# Altium schematic sheet V1.SchDoc
size A3
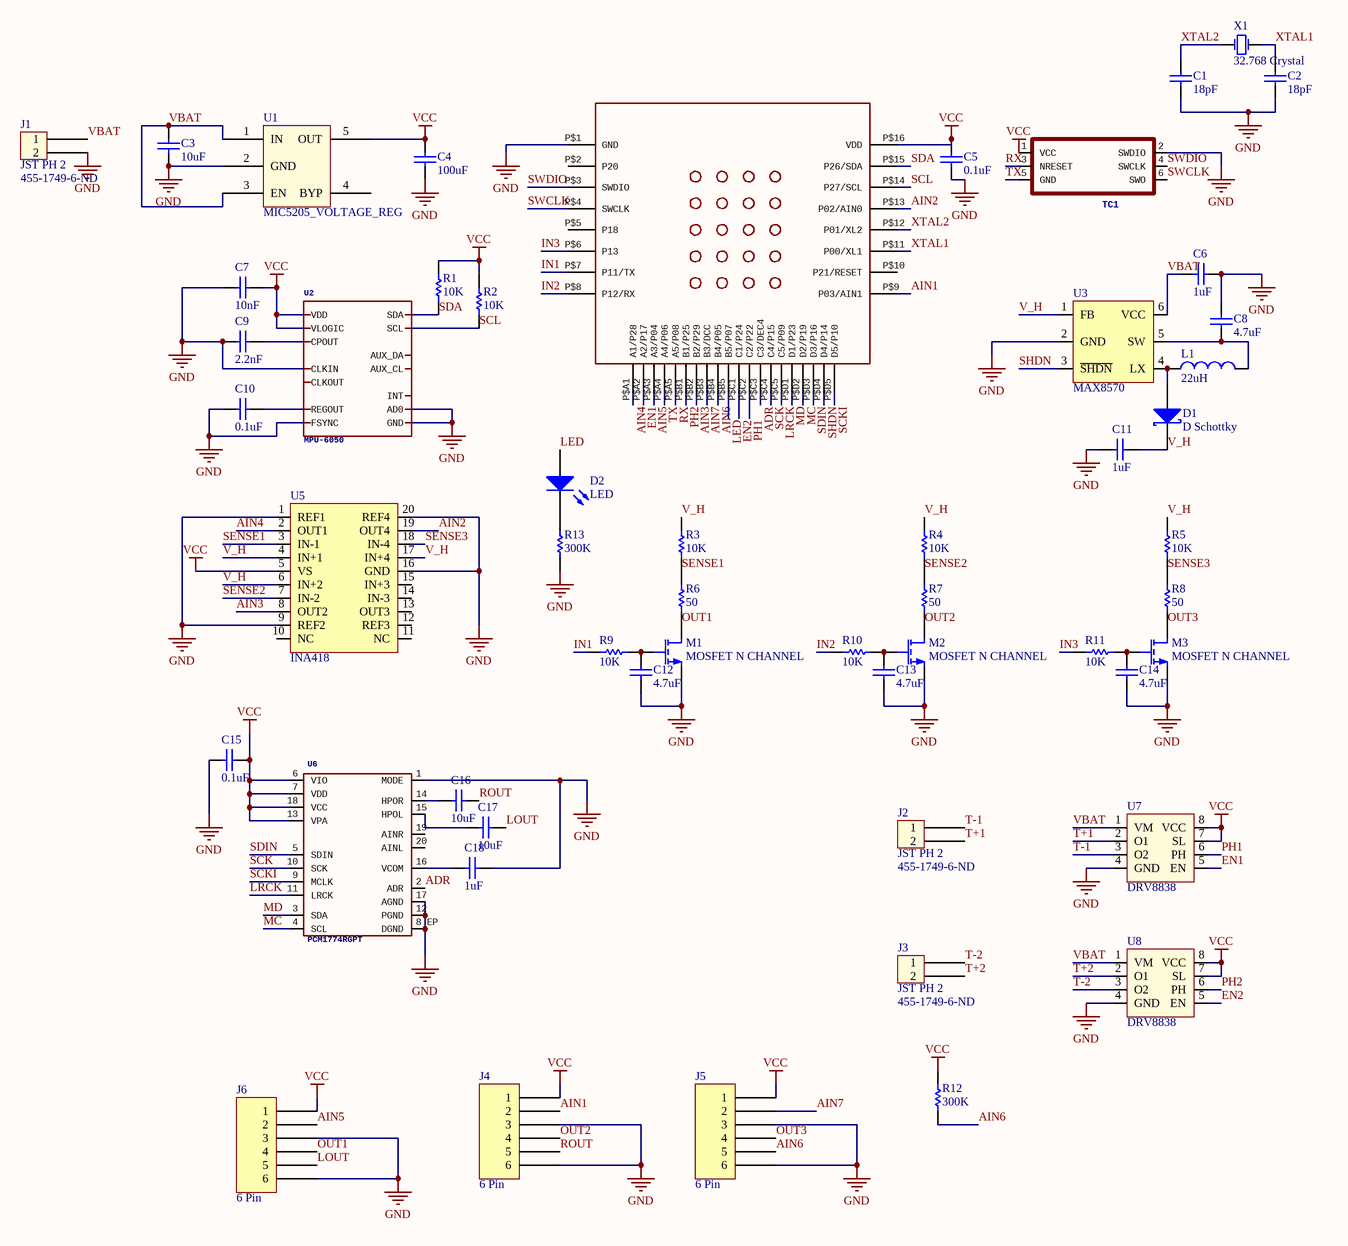
[diagram p0: V1.SchDoc]

## Parts
C1  18pF  [0603W]
C2  18pF  [0603W]
C3  10uF  [0603W]
C4  100uF  [0603W]
C5  0.1uF  [0603W]
C6  1uF  [0603W]
C7  10nF  [0603W]
C8  4.7uF  [0603W]
C9  2.2nF  [0603W]
C10  0.1uF  [0603W]
C11  1uF  [0603W]
C12  4.7uF  [0603W]
C13  4.7uF  [0603W]
C14  4.7uF  [0603W]
C15  0.1uF  [0603W]
C16  10uF  [0603W]
C17  10uF  [0603W]
C18  1uF  [0603W]
D1  D Schottky  [0603W]
D2  LED  [0603 LED]
J1  JST PH 2  Supplier Part Number 1: 455-1749-6-ND  [JST PH 2]
J2  JST PH 2  Supplier Part Number 1: 455-1749-6-ND  [JST PH 2]
J3  JST PH 2  Supplier Part Number 1: 455-1749-6-ND  [JST PH 2]
J4  6 Pin  [JST SM06B-SRSS-TB]
J5  6 Pin  [JST SM06B-SRSS-TB]
J6  6 Pin  [JST SM06B-SRSS-TB]
L1  22uH  [0603W]
M1  MOSFET N CHANNEL  [SOT323]
M2  MOSFET N CHANNEL  [SOT323]
M3  MOSFET N CHANNEL  [SOT323]
R1  10K  [0603W]
R2  10K  [0603W]
R3  10K  [0603W]
R4  10K  [0603W]
R5  10K  [0603W]
R6  50  [0603W]
R7  50  [0603W]
R8  50  [0603W]
R9  10K  [0603W]
R10  10K  [0603W]
R11  10K  [0603W]
R12  300K  [0603W]
R13  300K  [0603W]
TC1  (no value)  [TC2030-IDC-NL]
U1  MIC5205_VOLTAGE_REG  [SOT-23-5]
U2  MPU-6050  [QFN24]
U3  MAX8570  [SOT23-6]
U4  B3 DCC ,C3 DEC4 for power saving , 10uH , 15nH  [BC832]  (value not drawn)
U5  INA418  [TSSOP-20]
U6  PCM1774RGPT  [QFN20]
U7  DRV8838  [DRV8838]
U8  DRV8838  [DRV8838]
X1  32.768 Crystal  [32.768 Crystal]

## Nets
GND: C1.2 C2.1 C3.1 C4.1 C5.1 C6.1 C7.2 C8.1 C9.2 C10.2 C11.2 C12.2 C13.2 C14.2 C15.2 C18.1 J1.2 J4.3 J4.6 J5.3 J5.6 J6.3 J6.6 M1.2(S) M2.2(S) M3.2(S) R13.1 TC1.2(SWDIO) U1.2(GND) U2.1(CLKIN) U2.9(AD0) U2.11(FSYNC) U2.18(GND) U3.2(GND) U4.P$1(GND) U5.1(REF1) U5.9(REF2) U5.16(GND) U5.20(REF4) U6.1(MODE) U6.8_EP(DGND) U6.12(PGND) U6.17(AGND) U7.4(GND) U8.4(GND)
VCC: C4.2 C5.2 C7.1 C15.1 J4.1 J5.1 J6.1 R1.1 R2.1 R12.2 TC1.1(VCC) U1.5(OUT) U2.8(VLOGIC) U2.13(VDD) U4.P$16(VDD) U5.5(VS) U6.6(VIO) U6.7(VDD) U6.13(VPA) U6.18(VCC) U7.7(SL) U7.8(VCC) U8.7(SL) U8.8(VCC)
ADR: U4.P$C3(C3/DEC4) U6.2(ADR)
AIN1: J4.2 U4.P$9(P03/AIN1)
AIN2: U4.P$13(P02/AIN0) U5.19(OUT4)
AIN3: U4.P$B2(B2/P29) U5.8(OUT2)
AIN4: U4.P$A1(A1/P28) U5.2(OUT1)
AIN5: J6.2 U4.P$A3(A3/P04)
AIN6: J5.5 R12.1 U4.P$B4(B4/P05)
AIN7: J5.2 U4.P$B3(B3/DCC)
EN1: U4.P$A2(A2/P17) U7.5(EN)
EN2: U4.P$C1(C1/P24) U8.5(EN)
IN1: R9.1 U4.P$7(P11/TX)
IN2: R10.1 U4.P$8(P12/RX)
IN3: R11.1 U4.P$6(P13)
LED: D2.1(A) U4.P$B5(B5/P07)
LOUT: C17.1 J6.5
LRCK: U4.P$C5(C5/P09) U6.11(LRCK)
MC: U4.P$D2(D2/P19) U6.4(SCL)
MD: U4.P$D1(D1/P23) U6.3(SDA)
OUT1: J6.4 M1.3(D) R6.1
OUT2: J4.4 M2.3(D) R7.1
OUT3: J5.4 M3.3(D) R8.1
PH1: U4.P$C2(C2/P22) U7.6(PH)
PH2: U4.P$B1(B1/P25) U8.6(PH)
ROUT: C16.1 J4.5
RX: TC1.3(NRESET) U4.P$A5(A5/P08)
SCK: U4.P$C4(C4/P15) U6.10(SCK)
SCKI: U4.P$D5(D5/P10) U6.9(MCLK)
SCL: R2.2 U2.23(SCL) U4.P$14(P27/SCL)
SDA: R1.2 U2.24(SDA) U4.P$15(P26/SDA)
SDIN: U4.P$D3(D3/P16) U6.5(SDIN)
SENSE1: R3.1 R6.2 U5.3(IN-1)
SENSE2: R4.1 R7.2 U5.7(IN-2)
SENSE3: R5.1 R8.2 U5.18(IN-4)
SHDN: U3.3(~{SHDN}) U4.P$D4(D4/P14)
SWCLK: TC1.6(SWO) U4.P$4(SWCLK)
SWDIO: TC1.4(SWCLK) U4.P$3(SWDIO)
T+1: J2.2 U7.2(O1)
T+2: J3.2 U8.2(O1)
T-1: J2.1 U7.3(O2)
T-2: J3.1 U8.3(O2)
TX: TC1.5(GND) U4.P$A4(A4/P06)
V_H: C11.1 D1.2(K) R3.2 R4.2 R5.2 U3.1(FB) U5.4(IN+1) U5.6(IN+2) U5.17(IN+4)
VBAT: C3.2 C6.2 J1.1 U1.1(IN) U1.3(EN) U3.6(VCC) U7.1(VM) U8.1(VM)
XTAL1: C2.2 U4.P$11(P00/XL1) X1.2
XTAL2: C1.1 U4.P$12(P01/XL2) X1.1
NetC8_2: C8.2 L1.2 U3.5(SW)
NetC9_1: C9.1 U2.20(CPOUT)
NetC10_1: C10.1 U2.10(REGOUT)
NetC12_1: C12.1 M1.1(G) R9.2
NetC13_1: C13.1 M2.1(G) R10.2
NetC14_1: C14.1 M3.1(G) R11.2
NetC16_2: C16.2 U6.14(HPOR)
NetC17_2: C17.2 U6.15(HPOL)
NetC18_2: C18.2 U6.16(VCOM)
NetD1_1: D1.1(A) L1.1 U3.4(LX)
NetD2_2: D2.2(K) R13.2

Not connected (* = marked no-connect by the designer): U1 4(BYP); U2 6(AUX_DA) 7(AUX_CL) 12(INT) 22(CLKOUT); U4 P$2(P20) P$5(P18) P$10(P21/RESET); U5 10(NC) 11(NC) 12(REF3) 13(OUT3) 14(IN-3) 15(IN+3); U6 19(AINR) 20(AINL)

## Library data of the parts
C1-C18 = Capacitor: SMD Cap 0603; digikey part number: *; manufacturer: *; manufacturer part number: *
D1 = D Schottky: Schottky Diode; Published: 8-Jun-2000; LatestRevisionDate: 17-Jul-2002; LatestRevisionNote: Re-released for DXP Platform.; PackageReference: SMB; Publisher: Altium Limited; PackageDescription: DO-214-AA/SMB; 2 C-Bend Leads; Body 5.3 x 3.6 mm, inc. leads (LxW); Code_JEDEC: DO-214-AA
D2 = LED: LED SMD 1206/0603; digikey part number: *; manufacturer part number: *; manufacturer: *
L1 = Inductor
R1-R13 = Resistor: digikey part number: *; manufacturer: *; manufacturer part number: *
TC1 = TC2030-IDC-NL: GateName_1: A; DeviceName: -NL; SymbolName_1: TC2030-IDC; LibraryName: TagConnect; DeviceSetName: TC2030-IDC; Package: TC2030-IDC-NL
U1 = MIC5205_VOLTAGE_REG: 3.3V LDO SMD; Sparkfun #: PRT-1125
U2 = MPU-6050: GateName_1: G$1; SymbolName_1: MPU-6050; LibraryName: invensense; DeviceSetName: MPU-6050; Package: QFN.24.4X4
U4 = BC832-V1: GateName_1: G$1; SymbolName_1: BC832-V1; LibraryName: BC832; DeviceSetName: BC832-V1; Package: BC832
U6 = PCM1774RGPT: GateName_1: G$1; DeviceName: RGPT; SymbolName_1: PCM1774; LibraryName: TI; DeviceSetName: PCM1774; Package: QFN-20-4X4
J1-J3 = JST PH 2: Supplier 1: Digikey
M1-M3 = MOSFET N CHANNEL: digikey part number: 568-5987-1-ND
X1 = 32.768 Crystal: digikey number: XC1617CT-ND